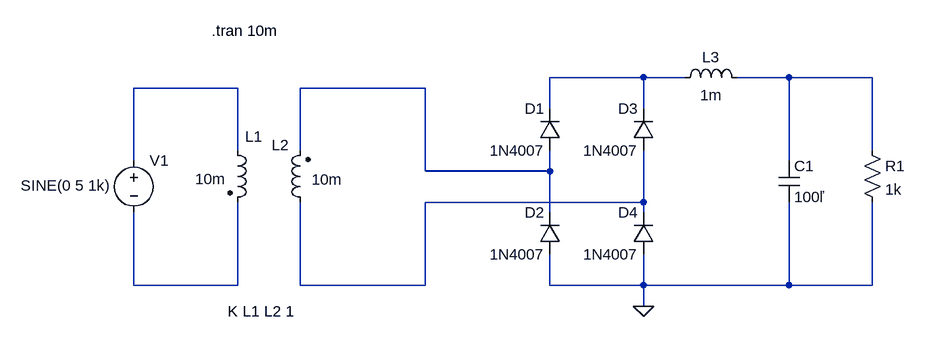
[diagram p0: schematic 1_FullWaveRectifier.asc]
1_FullWaveRectifier.asc, the LTspice schematic file:
Version 4
SHEET 1 1128 680
WIRE 720 32 576 32
WIRE 784 32 720 32
WIRE 944 32 864 32
WIRE 1072 32 944 32
WIRE 96 48 -64 48
WIRE 384 48 192 48
WIRE 576 80 576 32
WIRE 720 80 720 32
WIRE 96 144 96 48
WIRE 192 144 192 48
WIRE 1072 144 1072 32
WIRE -64 160 -64 48
WIRE 944 160 944 32
WIRE 384 176 384 48
WIRE 576 176 576 144
WIRE 576 176 384 176
WIRE 720 224 720 144
WIRE 720 224 384 224
WIRE 576 240 576 176
WIRE 720 240 720 224
WIRE -64 352 -64 240
WIRE 96 352 96 224
WIRE 96 352 -64 352
WIRE 192 352 192 224
WIRE 384 352 384 224
WIRE 384 352 192 352
WIRE 576 352 576 304
WIRE 720 352 720 304
WIRE 720 352 576 352
WIRE 944 352 944 224
WIRE 944 352 720 352
WIRE 1072 352 1072 224
WIRE 1072 352 944 352
WIRE 720 384 720 352
FLAG 720 384 0
SYMBOL voltage -64 144 R0
WINDOW 3 -174 54 Left 2
WINDOW 123 0 0 Left 0
WINDOW 39 0 0 Left 0
SYMATTR Value SINE(0 5 1k)
SYMATTR InstName V1
SYMBOL ind2 80 128 R0
WINDOW 0 27 -5 Left 2
WINDOW 3 -50 60 Left 2
SYMATTR InstName L1
SYMATTR Value 10m
SYMATTR Type ind
SYMATTR SpiceLine Rser=1
SYMBOL ind2 208 240 R180
WINDOW 0 33 104 Left 2
WINDOW 3 -49 51 Left 2
SYMATTR InstName L2
SYMATTR Value 10m
SYMATTR Type ind
SYMATTR SpiceLine Rser=1
SYMBOL diode 592 144 R180
WINDOW 0 24 64 Left 2
WINDOW 3 24 0 Left 2
SYMATTR InstName D1
SYMATTR Value 1N4007
SYMBOL diode 592 304 R180
WINDOW 0 24 64 Left 2
WINDOW 3 24 0 Left 2
SYMATTR InstName D2
SYMATTR Value 1N4007
SYMBOL diode 736 144 R180
WINDOW 0 24 64 Left 2
WINDOW 3 24 0 Left 2
SYMATTR InstName D3
SYMATTR Value 1N4007
SYMBOL diode 736 304 R180
WINDOW 0 24 64 Left 2
WINDOW 3 24 0 Left 2
SYMATTR InstName D4
SYMATTR Value 1N4007
SYMBOL res 1056 128 R0
SYMATTR InstName R1
SYMATTR Value 1k
SYMBOL cap 928 160 R0
SYMATTR InstName C1
SYMATTR Value 100ľ
SYMBOL ind 768 48 R270
WINDOW 0 32 56 VTop 2
WINDOW 3 5 56 VBottom 2
SYMATTR InstName L3
SYMATTR Value 1m
TEXT 80 392 Left 2 !K L1 L2 1
TEXT 56 -40 Left 2 !.tran 10m

The netlist it stands for:
* 1_FullWaveRectifier.asc
V1 N003 N006 SINE(0 5 1k)
L1 N003 N006 10m Rser=1
L2 N005 N004 10m Rser=1
D1 N004 N001 1N4007
D2 0 N004 1N4007
D3 N005 N001 1N4007
D4 0 N005 1N4007
R1 N002 0 1k
C1 N002 0 100ľ
L3 N001 N002 1m
.model D D
.lib standard.dio
K L1 L2 1
.tran 10m
.backanno
.end